# EAGLE design LEDALPanel (EAGLE 6.5.0)
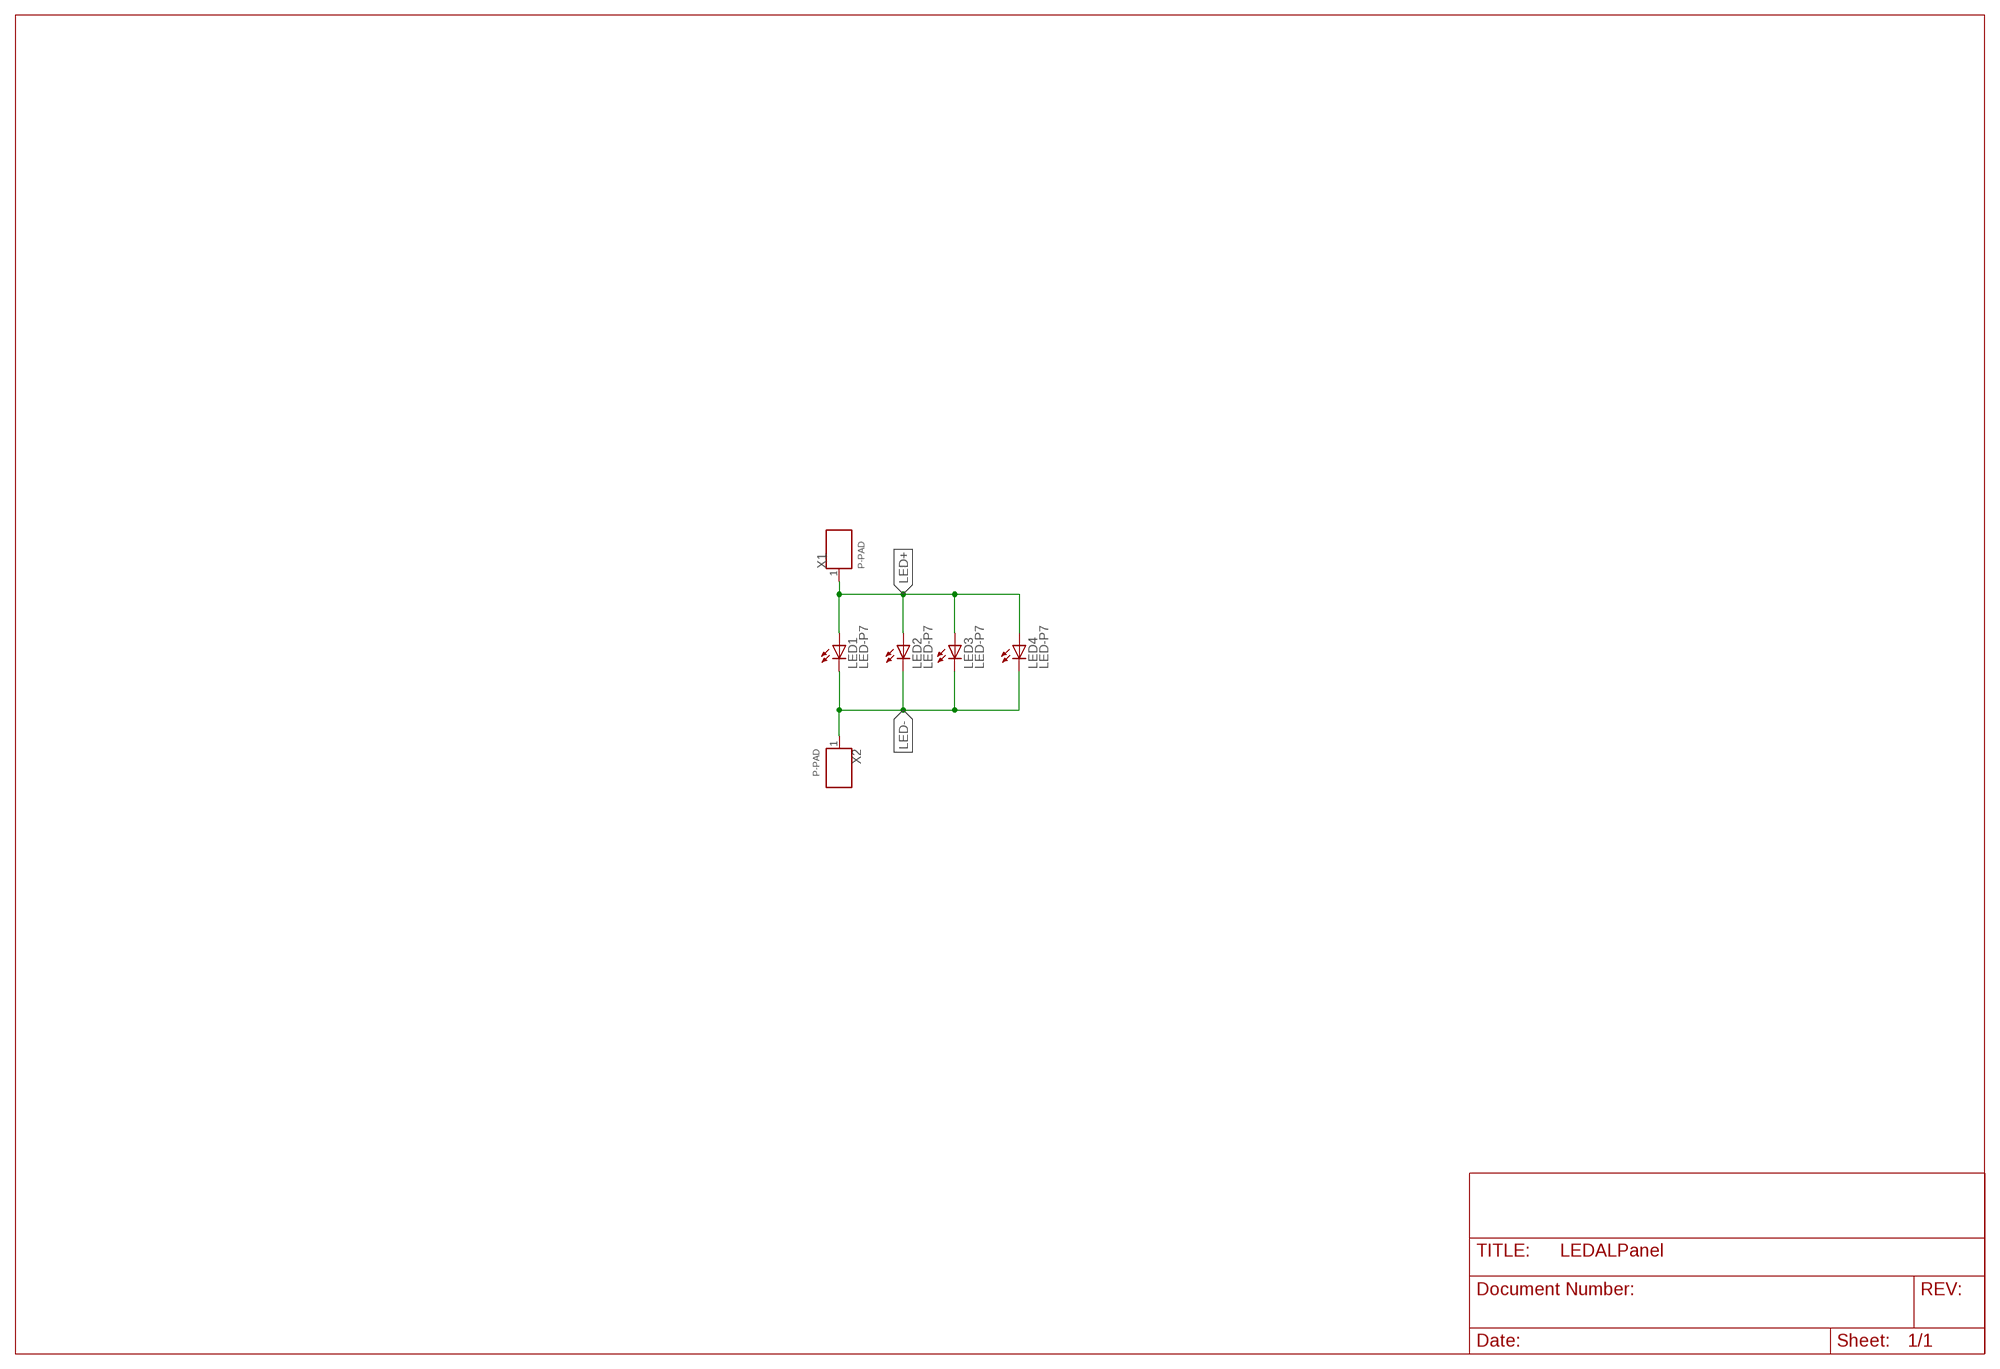
[diagram p0: schematic, sheet 1]

## Parts
LED1  LED-P7  [P7]
LED2  LED-P7  [P7]
LED3  LED-P7  [P7]
LED4  LED-P7  [P7]
X1  P-PAD  [P-PAD]
X2  P-PAD  [P-PAD]

## Nets
LED+: LED1.A LED2.A LED3.A LED4.A X1.1
LED-: LED1.C LED2.C LED3.C LED4.C X2.1

## Library data of the parts
LED1-LED4 = OSSI:LED
X1 X2 = OSSI:P-PAD

## Board
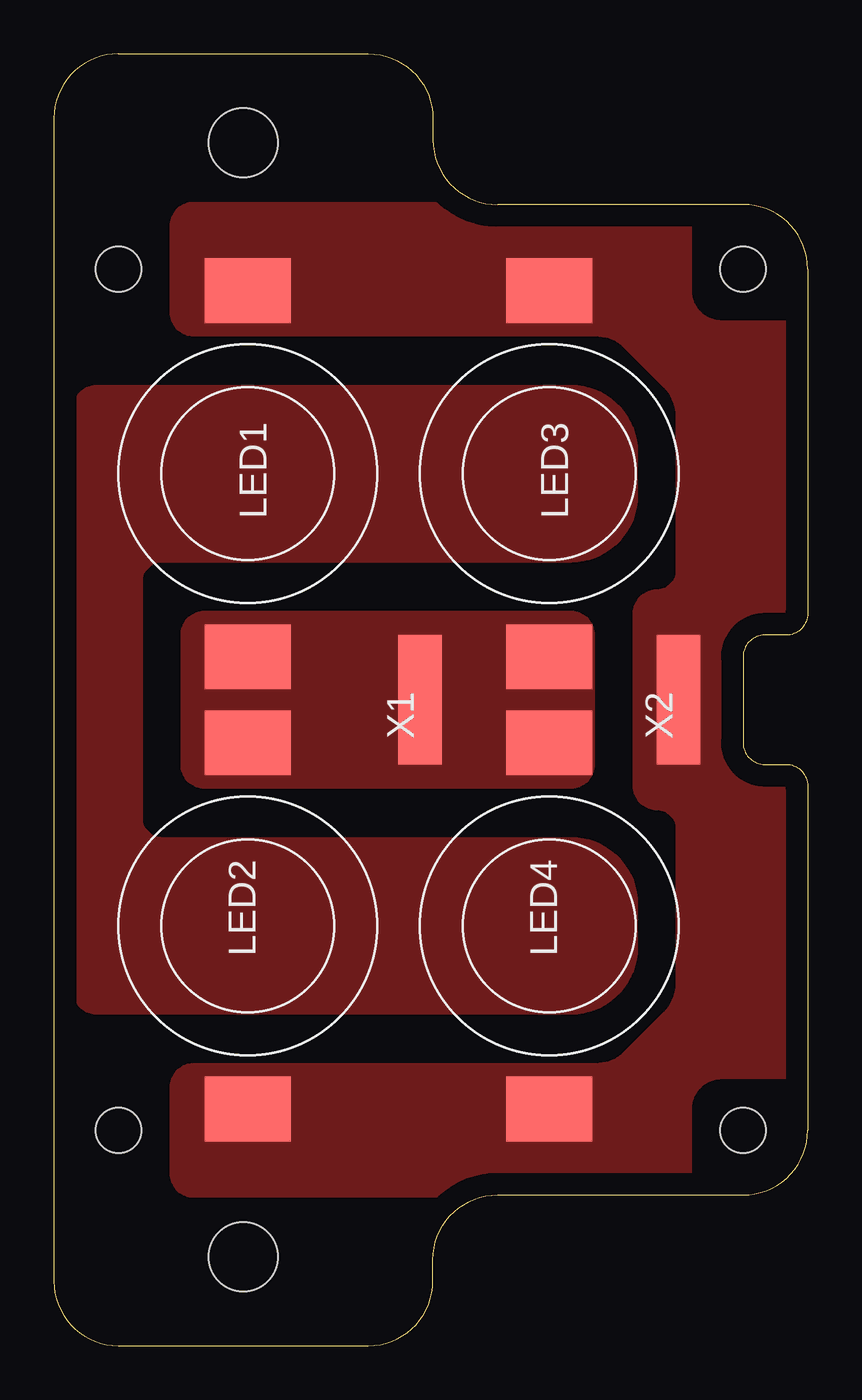
[diagram p1: board, top side]

Size 35 x 60 mm. Coordinates in mm from the lower left corner, seen from the top.
Outline: 3,60 14.6,60 arc-90 17.6,57 17.6,56 arc90 20.6,53 32,53 arc-90 35,50 35,34 arc-90 34,33 33,33 arc90 32,32 32,28 arc90 33,27 34,27 arc-90 35,26 35,10 arc-90 32,7 20.6,7 arc90 17.6,4 17.6,3 arc-90 14.6,0 3,0 arc-90 0,3 0,57 arc-90 3,60
Copper layers (1*16): Top 0.035mm / dielectric 1.5mm / Bottom 0.035mm
Design rules "default": minimum track width 10mil, minimum drill 24mil, track to track 8mil, track to pad 8mil, pad to pad 8mil, via to via 8mil, smd to smd 8mil, copper to edge 40mil, drill to drill 8mil, minimum pad ring 10mil, minimum via ring 8mil, stop-mask expansion 4mil, vias tented up to drill 0mil, thermal gap 10mil
Holes 3.2 mm at 8.8,4.12 8.8,55.88
Holes 2.1 mm at 32,10 32,50 3,50 3,10

### Footprints (pad centres in the part's own frame; a part is rotated, then mirrored left to right if it is on the bottom)
P7 = smd 3 x 4: A -8.5,0; C 8.5,0
P-PAD = smd 6 x 2: 1 0,0

### Placement (x,y rotation side)
LED1  9,40.5 90 top
LED2  9,19.5 270 top
LED3  23,40.5 90 top
LED4  23,19.5 270 top
X1  17,30 90 top
X2  29,30 90 top

### Tracks (layer width: path | path; a pad name or v marks a point on that pad's centre or on a via)
LED+
  pour Top (isolate 0.61, no thermals): 24,34 7,34 arc90 6,33 6,27 arc90 7,26 24,26 arc90 25,27 25,33 arc90
LED-
  pour Top (isolate 0.61, no thermals): 5.5,12 5.5,8 arc90 6.5,7 29.5,7 29.5,11 arc-90 31,12.5 35,12.5 35,27 33,27 arc-90 32,28 32,32 arc-90 33,33 35,33 35,47.5 31,47.5 arc-90 29.5,49 29.5,53 6.5,53 arc90 5.5,52 5.5,48 arc90 6.5,47 25.17,47 arc-45 26.59,46.41 28.41,44.59 arc-45 29,43.17 29,36 arc-90 28,35 arc90 27,34 27,26 arc90 28,25 arc-90 29,24 29,16.83 arc-45 28.41,15.41 26.59,13.59 arc-45 25.17,13 6.5,13 arc90
N$3
  pour Top (isolate 0.61): 2,15.5 24,15.5 arc90 27,18.5 27,20.5 arc90 24,23.5 5,23.5 arc-90 4,24.5 4,35.5 arc-90 5,36.5 24,36.5 arc90 27,39.5 27,41.5 arc90 24,44.5 2,44.5 arc90 1,43.5 1,16.5 arc90